# Altium project SecurityTerminalV1.1.PrjPCB
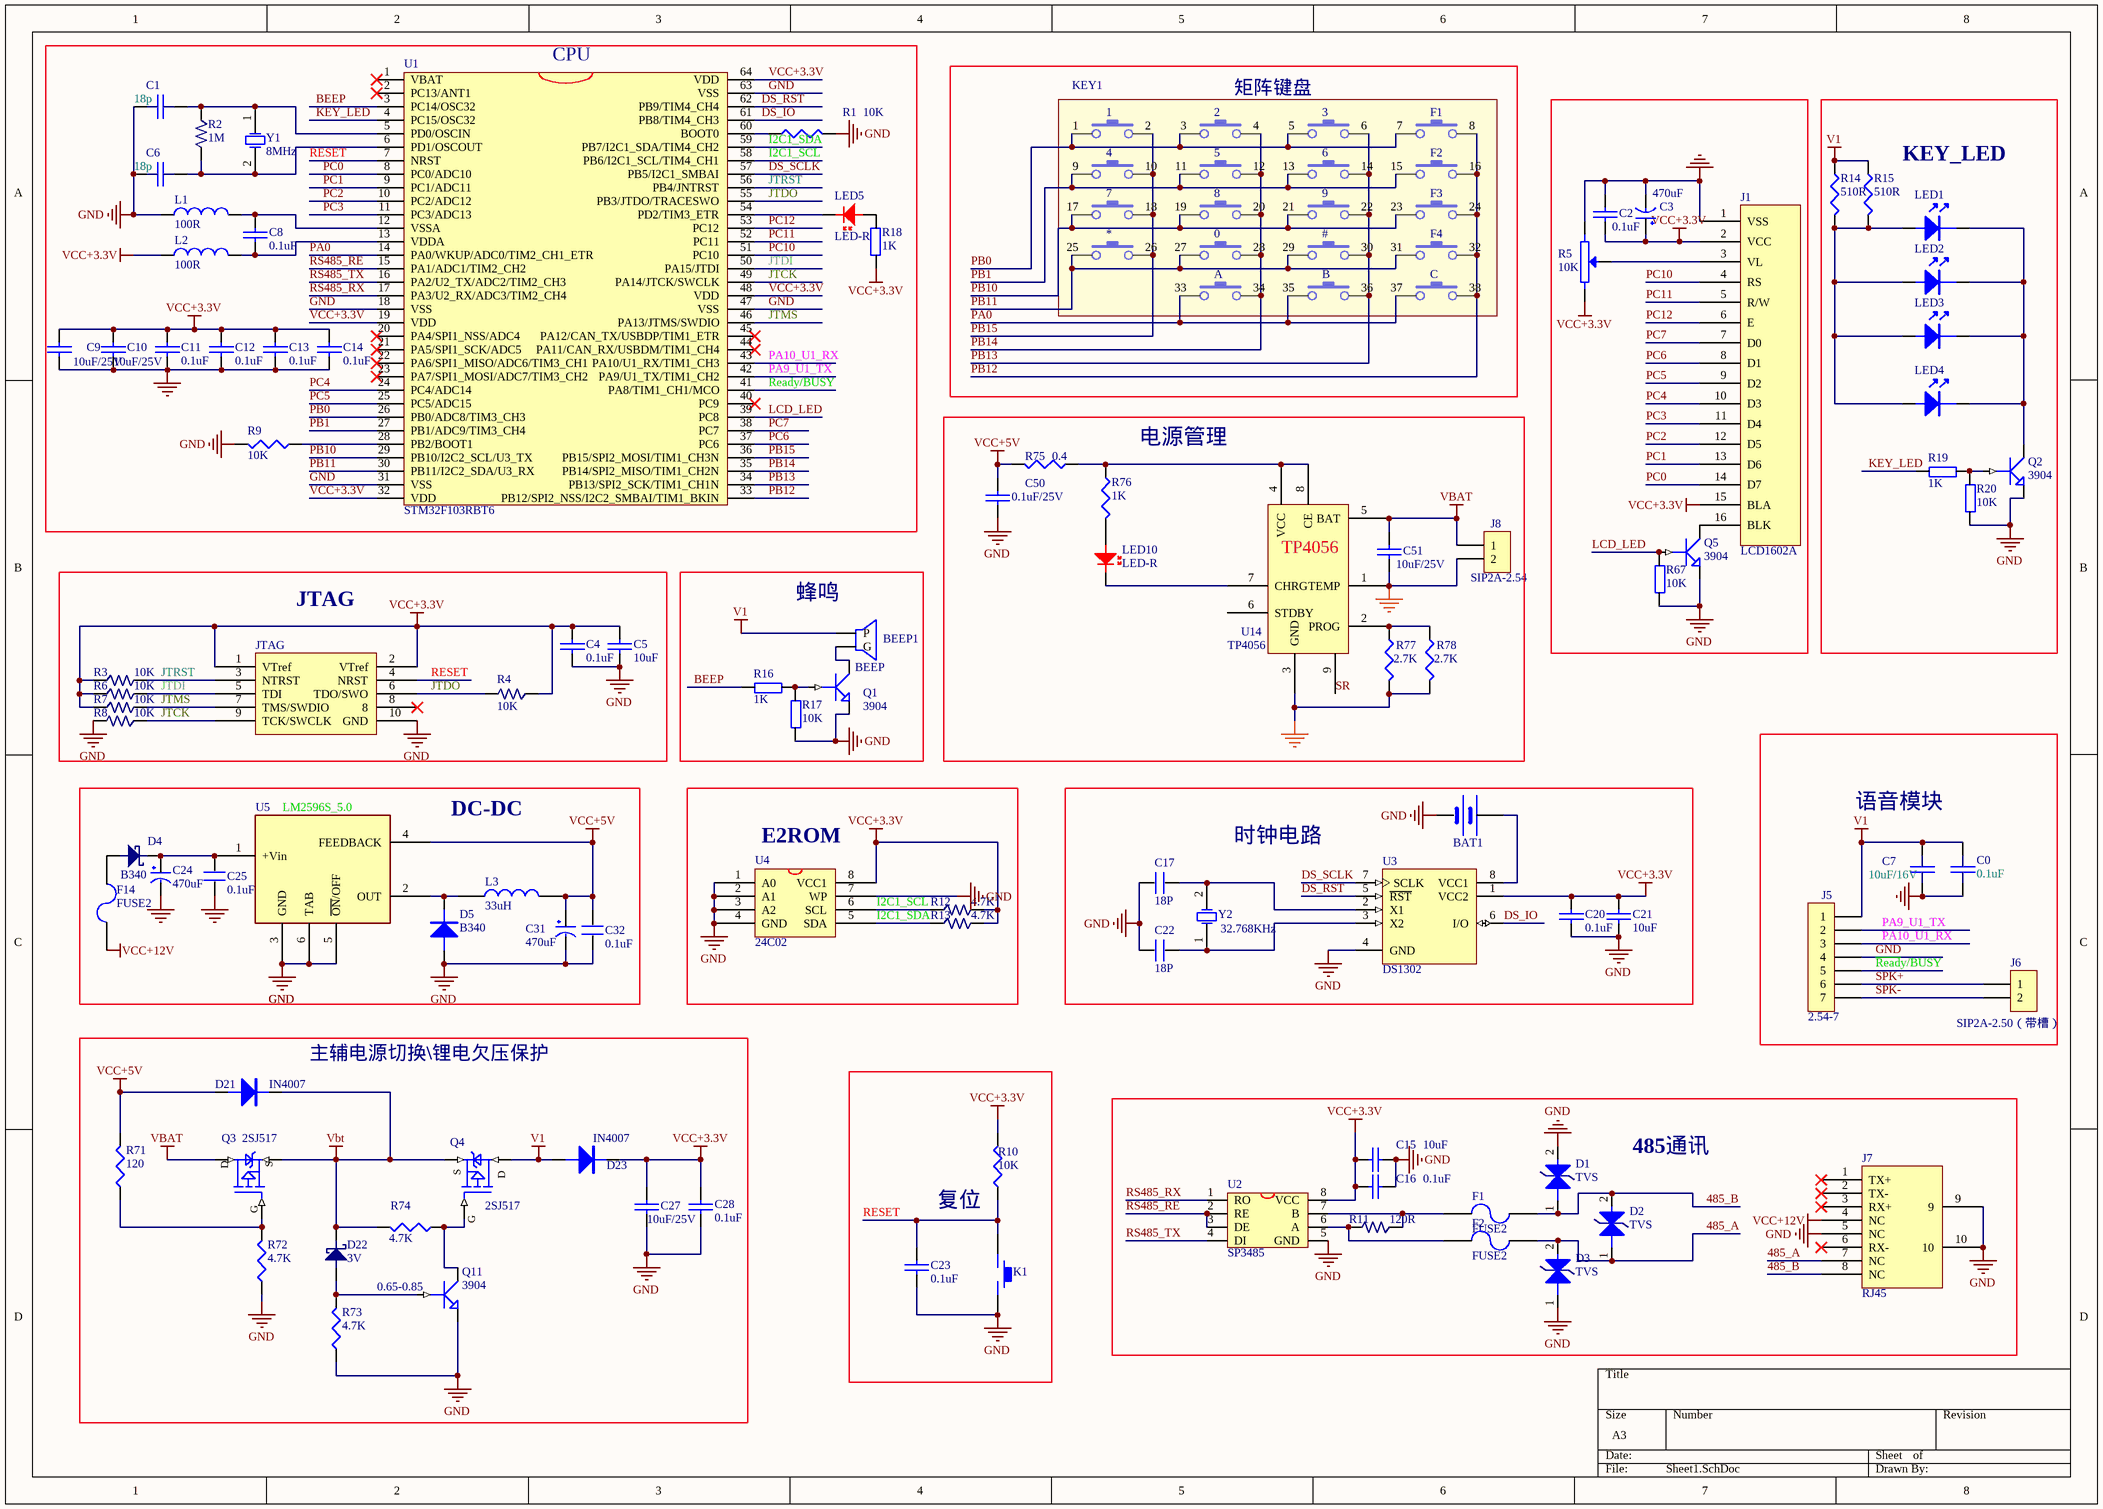
[diagram p0: Sheet1.SchDoc]
1 sheet, 103 parts. Net scope: global (net labels, ports and power ports of the same name join across sheets).
Board file: PCB2.PcbDoc

## Sheet Sheet1.SchDoc
size A3

### Parts
BAT1  BATT  [CR1220]  (value not drawn)
BEEP1  BEEP  [BEEP-12W]
C0  0.1uF  [0603]
C1  18p  [0603]
C2  0.1uF  [0603]
C3  470uF  [RB3.5-w]
C4  0.1uF  [0603]
C5  10uF  [0805]
C6  18p  [0603]
C7  10uF/16V  [0805]
C8  0.1uF  [0603]
C9  10uF/25V  [0805]
C10  10uF/25V  [0805]
C11  0.1uF  [0603]
C12  0.1uF  [0603]
C13  0.1uF  [0603]
C14  0.1uF  [0603]
C15  10uF  [0805]
C16  0.1uF  [0603]
C17  18P  [0603]
C20  0.1uF  [0603]
C21  10uF  [0805]
C22  18P  [0603]
C23  0.1uF  [0603]
C24  470uF  [RB3.5-w]
C25  0.1uF  [0603]
C27  10uF/25V  [0805]
C28  0.1uF  [0805]
C31  470uF  [RB3.5-w]
C32  0.1uF  [0603]
C50  0.1uF/25V  [0603]
C51  10uF/25V  [0805]
D1  TVS  [SMB]
D2  TVS  [SMB]
D3  TVS  [SMB]
D4  B340  [SMB]
D5  B340  [SMB]
D21  IN4007  [SMA(DO-214AC)]
D22  3V  [sod-123]
D23  IN4007  [SMB]
F1  FUSE2  [0805]
F2  FUSE2  [0805]
F14  FUSE2  [FUSE-RL60-050]
J1  LCD1602A  [LCD-1602A]
J2  JTAG  [JTAG_10]
J5  2.54-7  [SYN6288]
J6  SIP2A-2.50（带槽）  [2.54]
J7  RJ45  [RJ45-1]
J8  SIP2A-2.54  [2.54]
K1  KEY_M  [KEY_M]  (value not drawn)
KEY1  SW-17  [KEY-17]  (value not drawn)
L1  100R  [0805]
L2  100R  [0805]
L3  33uH  [INDUCTOR-1212]
LED1  (no value)  [LED-0805]
LED2  (no value)  [LED-0805]
LED3  (no value)  [LED-0805]
LED4  (no value)  [LED-0805]
LED5  LED-R  [LED-0805]
LED10  LED-R  [LED-0805]
Q1  3904  [SOT-23]
Q2  3904  [SOT-23]
Q3  2SJ517  [SOT-89]
Q4  2SJ517  [SOT-89]
Q5  3904  [SOT-23]
Q11  3904  [SOT-23]
R1  10K  [0603]
R2  1M  [0603]
R3  10K  [0603]
R4  10K  [0603]
R5  10K  [RM065-V1]
R6  10K  [0603]
R7  10K  [0603]
R8  10K  [0603]
R9  10K  [0603]
R10  10K  [0603]
R11  120R  [0603]
R12  4.7K  [0603]
R13  4.7K  [0603]
R14  510R  [0805]
R15  510R  [0805]
R16  1K  [0603]
R17  10K  [0603]
R18  1K  [0603]
R19  1K  [0805]
R20  10K  [0805]
R67  10K  [0805]
R71  120  [0805]
R72  4.7K  [0805]
R73  4.7K  [0805]
R74  4.7K  [0805]
R75  0.4  [1206]
R76  1K  [0603]
R77  2.7K  [0603]
R78  2.7K  [0603]
U1  STM32F103RBT6  [LQFP64_N]
U2  SP3485  [SOP-8]
U3  DS1302  [SOP-8]
U4  24C02  [SO-8]
U5  LM2596S_5.0  [TO-263-5]
U14  TP4056  [SO8E]
Y1  8MHz  [XTAL_US]
Y2  32.768KHz  [cs-308]

### Blocks framed on the sheet
CPU: C1 C6 C8-C14 L1 L2 LED5 R1 R2 R9 R18 U1 Y1
矩阵键盘: KEY1
KEY_LED: LED1-LED4 Q2 R14 R15 R19 R20
电源管理: C50 C51 J8 LED10 R75-R78 U14
JTAG: C4 C5 J2 R3 R4 R6-R8
蜂鸣: BEEP1 Q1 R16 R17
语音模块: C0 C7 J5 J6
DC-DC: C24 C25 C31 C32 D4 D5 F14 L3 U5
时钟电路: BAT1 C17 C20-C22 U3 Y2
主辅电源切换\锂电欠压保护: C27 C28 D21-D23 Q3 Q4 Q11 R71-R74
复位: C23 K1 R10
485通讯: C15 C16 D1-D3 F1 F2 J7 R11 U2

### Nets
GND: BAT1.2(GND) C0.1 C1.2 C2.2 C3.2(GND) C4.1 C5.1 C6.2 C7.1 C9.1 C10.1 C11.1 C12.1 C13.1 C14.1 C15.2 C16.2 C17.1 C20.1 C21.1 C22.1 C23.2 C24.2(GND) C25.1 C27.2 C28.2 C31.2(GND) C32.1 C50.2 C51.2 D1.2(K) D3.1(A) D5.1(A) J1.1(VSS) J2.10(GND) J5.4 J7.5(NC) J7.9 J7.10 J8.2 K1.2 L1.1 Q1.2(E) Q2.2(E) Q5.2(E) Q11.2(E) R1.2 R5.1 R8.2 R9.2 R17.1 R20.1 R67.1 R72.1 R73.1 R77.2 R78.2 U1.18(VSS) U1.31(VSS) U1.47(VSS) U1.63(VSS) U2.5(GND) U3.4(GND) U4.1(A0) U4.2(A1) U4.3(A2) U4.4(GND) U4.7(WP) U5.3(GND) U5.5(~{ON}/OFF) U5.6(TAB) U14.1(TEMP) U14.3(GND)
V1: BEEP1.1(P) C0.2 C7.2 D23.1(A) J5.1 Q4.2(D) R14.1 R15.1
VBAT: C51.1 J8.1 Q3.2(D) U14.5(BAT)
Vbt: D21.2(K) D22.2 Q3.3(S) Q4.3(S) R74.2
VCC+3.3V: C2.1 C3.1(VCC) C4.2 C5.2 C9.2 C10.2 C11.2 C12.2 C13.2 C14.2 C15.1 C16.1 C20.2 C21.2 C27.1 C28.1 D23.2(K) J1.2(VCC) J1.15(BLA) J2.1(VTref) J2.2(VTref) L2.1 R3.1 R4.1 R5.3 R6.1 R7.1 R10.2 R12.2 R13.2 R18.2 U1.19(VDD) U1.32(VDD) U1.48(VDD) U1.64(VDD) U2.8(VCC) U3.1(VCC2) U4.8(VCC1)
VCC+5V: C31.1(VCC) C32.2 C50.1 D21.1(A) L3.2 R71.2 R75.2 U5.4(FEEDBACK)
VCC+12V: F14.1 J7.4(NC)
485_A: D2.1(A) D3.2(K) F2.2 J7.7(NC)
485_B: D1.1(A) D2.2(K) F1.2 J7.8(NC)
BEEP: R16.1 U1.3(PC14/OSC32)
DS_IO: U1.61(PB8/TIM4_CH3) U3.6(I/O)
DS_RST: U1.62(PB9/TIM4_CH4) U3.5(~{RST})
DS_SCLK: U1.57(PB5/I2C1_SMBAI) U3.7(SCLK)
I2C1_SCL: R12.1 U1.58(PB6/I2C1_SCL/TIM4_CH1) U4.6(SCL)
I2C1_SDA: R13.1 U1.59(PB7/I2C1_SDA/TIM4_CH2) U4.5(SDA)
JTCK: J2.9(TCK/SWCLK) R8.1 U1.49(PA14/JTCK/SWCLK)
JTDI: J2.5(TDI) R6.2 U1.50(PA15/JTDI)
JTDO: J2.6(TDO/SWO) R4.2 U1.55(PB3/JTDO/TRACESWO)
JTMS: J2.7(TMS/SWDIO) R7.2 U1.46(PA13/JTMS/SWDIO)
JTRST: J2.3(NTRST) R3.2 U1.56(PB4/JNTRST)
KEY_LED: R19.1 U1.4(PC15/OSC32)
LCD_LED: Q5.1(B) R67.2 U1.39(PC8)
PA0: KEY1.33 KEY1.35 KEY1.37 U1.14(PA0/WKUP/ADC0/TIM2_CH1_ETR)
PA9_U1_TX: J5.2 U1.42(PA9/U1_TX/TIM1_CH2)
PA10_U1_RX: J5.3 U1.43(PA10/U1_RX/TIM1_CH3)
PB0: KEY1.1 KEY1.3 KEY1.5 KEY1.7 U1.26(PB0/ADC8/TIM3_CH3)
PB1: KEY1.9 KEY1.11 KEY1.13 KEY1.15 U1.27(PB1/ADC9/TIM3_CH4)
PB10: KEY1.17 KEY1.19 KEY1.21 KEY1.23 U1.29(PB10/I2C2_SCL/U3_TX)
PB11: KEY1.25 KEY1.27 KEY1.29 KEY1.31 U1.30(PB11/I2C2_SDA/U3_RX)
PB12: KEY1.8 KEY1.16 KEY1.24 KEY1.32 KEY1.38 U1.33(PB12/SPI2_NSS/I2C2_SMBAI/TIM1_BKIN)
PB13: KEY1.6 KEY1.14 KEY1.22 KEY1.30 KEY1.36 U1.34(PB13/SPI2_SCK/TIM1_CH1N)
PB14: KEY1.4 KEY1.12 KEY1.20 KEY1.28 KEY1.34 U1.35(PB14/SPI2_MISO/TIM1_CH2N)
PB15: KEY1.2 KEY1.10 KEY1.18 KEY1.26 U1.36(PB15/SPI2_MOSI/TIM1_CH3N)
PC0: J1.14(D7) U1.8(PC0/ADC10)
PC1: J1.13(D6) U1.9(PC1/ADC11)
PC2: J1.12(D5) U1.10(PC2/ADC12)
PC3: J1.11(D4) U1.11(PC3/ADC13)
PC4: J1.10(D3) U1.24(PC4/ADC14)
PC5: J1.9(D2) U1.25(PC5/ADC15)
PC6: J1.8(D1) U1.37(PC6)
PC7: J1.7(D0) U1.38(PC7)
PC10: J1.4(RS) U1.51(PC10)
PC11: J1.5(R/W) U1.52(PC11)
PC12: J1.6(E) U1.53(PC12)
~{Read}y/BUSY: J5.5 U1.41(PA8/TIM1_CH1/MCO)
RESET: C23.1 J2.4(NRST) K1.1 R10.1 U1.7(NRST)
RS485_RE: U1.15(PA1/ADC1/TIM2_CH2) U2.2(RE) U2.3(DE)
RS485_RX: U1.17(PA3/U2_RX/ADC3/TIM2_CH4) U2.1(RO)
RS485_TX: U1.16(PA2/U2_TX/ADC2/TIM2_CH3) U2.4(DI)
SPK+: J5.6 J6.1
SPK-: J5.7 J6.2
SR: U14.9
NetBAT1_1: BAT1.1(VCC) U3.8(VCC1)
NetBEEP1_2: BEEP1.2(G) Q1.3(C)
NetC1_1: C1.1 R2.1 U1.5(PD0/OSCIN) Y1.1(OSC1)
NetC6_1: C6.1 R2.2 U1.6(PD1/OSCOUT) Y1.2(OSC2)
NetC8_1: C8.1 L2.2 U1.13(VDDA)
NetC8_2: C8.2 L1.2 U1.12(VSSA)
NetC17_2: C17.2 U3.2(X1) Y2.2(OSC2)
NetC22_2: C22.2 U3.3(X2) Y2.1(OSC1)
NetC24_1: C24.1(VCC) C25.2 D4.2 U5.1(+Vin)
NetD4_1: D4.1 F14.2
NetD5_2: D5.2(K) L3.1 U5.2(OUT)
NetD22_1: D22.1 Q11.1(B) R73.2
NetF1_1: F1.1 R11.1 U2.7(B)
NetF2_1: F2.1 R11.2 U2.6(A)
NetJ1_3: J1.3(VL) R5.2
NetJ1_16: J1.16(BLK) Q5.3(C)
NetLED1_1: LED1.1 LED2.1 LED3.1 LED4.1 R14.2 R15.2
NetLED1_2: LED1.2 LED2.2 LED3.2 LED4.2 Q2.3(C)
NetLED5_1: LED5.1 R18.1
NetLED5_2: LED5.2 U1.54(PD2/TIM3_ETR)
NetLED10_1: LED10.1 R76.2
NetLED10_2: LED10.2 U14.7(CHRG)
NetQ1_1: Q1.1(B) R16.2 R17.2
NetQ2_1: Q2.1(B) R19.2 R20.2
NetQ3_1: Q3.1(G) R71.1 R72.2
NetQ4_1: Q4.1(G) Q11.3(C) R74.1
NetR1_1: R1.1 U1.60(BOOT0)
NetR9_1: R9.1 U1.28(PB2/BOOT1)
NetR75_1: R75.1 R76.1 U14.4(VCC) U14.8(CE)
NetR77_1: R77.1 R78.1 U14.2(PROG)

Not connected (* = marked no-connect by the designer): J2 8*; J7 1(TX+)* 2(TX-)* 3(RX+)* 6(RX-)*; U1 1(VBAT)* 2(PC13/ANT1)* 20(PA4/SPI1_NSS/ADC4)* 21(PA5/SPI1_SCK/ADC5)* 22(PA6/SPI1_MISO/ADC6/TIM3_CH1)* 23(PA7/SPI1_MOSI/ADC7/TIM3_CH2)* 40(PC9)* 44(PA11/CAN_RX/USBDM/TIM1_CH4)* 45(PA12/CAN_TX/USBDP/TIM1_ETR)*; U14 6(STDBY)

### Notes on the sheet
- (near KEY1) 1
- (near KEY1) 4
- (near KEY1) 2
- (near KEY1) 5
- (near KEY1) 3
- (near KEY1) 6
- (near KEY1) F1
- (near KEY1) F2
- (near KEY1) 7
- (near KEY1) *
- (near KEY1) 8
- (near KEY1) 0
- (near KEY1) 9
- (near KEY1) #
- (near KEY1) F3
- (near KEY1) F4
- (near KEY1) A
- (near KEY1) B
- (near KEY1) C
- (near U4) E2ROM
- (near Q11) 0.65-0.85

### Library data of the parts
BAT1 = BAT
C0 C1 C6 C7 = CAP: 陶瓷电容
C2-C5 C8-C16 C20 C21 C23 C24 C27 C28 C31 C50 C51 = CAP
C17 C22 C25 C32 = C
D1-D3 = TVS: SMBJ12CA
D4 = 1N5824(SS54): 肖特基二极管
D5 D21 D23 = DIODE
D22 = 1N5824(SS54): 3V稳压管
F1 F2 = FUSE2: SMD0805P010TS
F14 = FUSE2: RL60-050
J2 = JTAG_10
J8 = SIP2A-2.50（带槽）
L1-L3 = INDUCTOR
LED1-LED4 = LED: 蓝色LED
LED5 = LED-RED: 绿色LED
LED10 = LED-RED: 红色LED
Q1 Q2 Q5 Q11 = NPN1
Q3 Q4 = MOSFET P_1
R1 R9 R10 R14 R15 R75-R78 = RES1
R2-R4 R6-R8 R11-R13 = RES-1%: 高精度电阻
R5 = POT2
R16 R17 R19 R20 R67 = R
R18 = Res
R71-R74 = RESISTOR
U2 = MAX3485
U3 = DS1302: 实时时钟
U4 = 24C256
U5 = LM2596S_5.0: 3A开关电源芯片
Y1 Y2 = XTAL: Crystal Oscillator; Published: 8-Jun-2000; LatestRevisionDate: 17-Jul-2002; LatestRevisionNote: Re-released for DXP Platform.; Publisher: Altium Limited